# Altium schematic sheet PowerRails.SchDoc
size A4
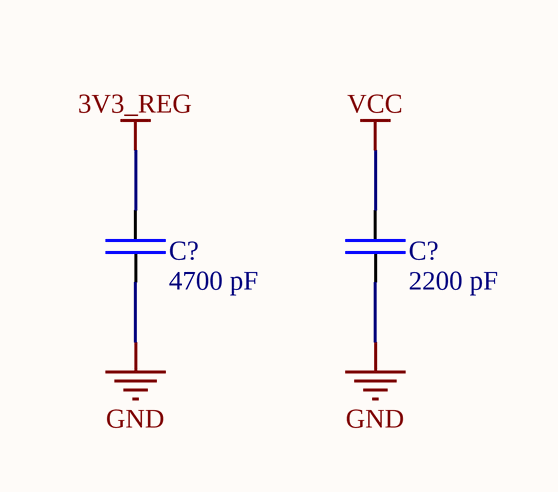
[diagram p0: PowerRails.SchDoc]

## Parts
(Parts that share a designator on the sheet are numbered #1, #2 ... from top to bottom, then left to right.)
C?#1  4700 pF  [4700uF 0805]
C?#2  2200 pF  [4700uF 0805]

## Nets
3V3_REG: C?#1.2
GND: C?#1.1 C?#2.1
VCC: C?#2.2

## Library data of the parts
C?#1 C?#2 = 4700pF 0805: KEMET - C0805C472K5RACTU - CERAMIC CAPACITOR 4700PF, 50V, X7R, 10%, 0805; Capacitance: 4.7nF; Rule: UNIONINDEX=0|RULEKIND=Width|NETSCOPE=AnyNet|LAYERKIND=SameLayer|NAME=Schematic Width Constraint|MAXLIMIT=15mil|MINLIMIT=15mil|PREFEREDWIDTH=15mil|MIDLAYER1_MINWIDTH=10mil|MIDLAYER1_MAXWIDTH=10mil|MIDLAYER1_PREFWIDTH=10mil|MIDLAYER2_MINWIDTH=10mil|MIDLAYER2_MAXWIDTH=10mil|MIDLAYER2_PREFWIDTH=10mil|MIDLAYER3_MINWIDTH=10mil|MIDLAYER3_MAXWIDTH=10mil|MIDLAYER3_PREFWIDTH=10mil|MIDLAYER4_MINWIDTH=10mil|MIDLAYER4_MAXWIDTH=10mil|MIDLAYER4_PREFWIDTH=10mil|MIDLAYER5_MINWIDTH=10mil|MIDLAYER5_MAXWIDTH=10mil|MIDLAYER5_PREFWIDTH=10mil|MIDLAYER6_MINWIDTH=10mil|MIDLAYER6_MAXWIDTH=10mil|MIDLAYER6_PREFWIDTH=10mil|MIDLAYER7_MINWIDTH=10mil|MIDLAYER7_MAXWIDTH=10mil|MIDLAYER7_PREFWIDTH=10mil|MIDLAYER8_MINWIDTH=10mil|MIDLAYER8_MAXWIDTH=10mil|MIDLAYER8_PREFWIDTH=10mil|MIDLAYER9_MINWIDTH=10mil|MIDLAYER9_MAXWIDTH=10mil|MIDLAYER9_PREFWIDTH=10mil|MIDLAYER10_MINWIDTH=10mil|MIDLAYER10_MAXWIDTH=10mil|MIDLAYER10_PREFWIDTH=10mil|MIDLAYER11_MINWIDTH=10mil|MIDLAYER11_MAXWIDTH=10mil|MIDLAYER11_PREFWIDTH=10mil|MIDLAYER12_MINWIDTH=10mil|MIDLAYER12_MAXWIDTH=10mil|MIDLAYER12_PREFWIDTH=10mil|MIDLAYER13_MINWIDTH=10mil|MIDLAYER13_MAXWIDTH=10mil|MIDLAYER13_PREFWIDTH=10mil|MIDLAYER14_MINWIDTH=10mil|MIDLAYER14_MAXWIDTH=10mil|MIDLAYER14_PREFWIDTH=10mil|MIDLAYER15_MINWIDTH=10mil|MIDLAYER15_MAXWIDTH=10mil|MIDLAYER15_PREFWIDTH=10mil|MIDLAYER16_MINWIDTH=10mil|MIDLAYER16_MAXWIDTH=10mil|MIDLAYER16_PREFWIDTH=10mil|MIDLAYER17_MINWIDTH=10mil|MIDLAYER17_MAXWIDTH=10mil|MIDLAYER17_PREFWIDTH=10mil|MIDLAYER18_MINWIDTH=10mil|MIDLAYER18_MAXWIDTH=10mil|MIDLAYER18_PREFWIDTH=10mil|MIDLAYER19_MINWIDTH=10mil|MIDLAYER19_MAXWIDTH=10mil|MIDLAYER19_PREFWIDTH=10mil|MIDLAYER20_MINWIDTH=10mil|MIDLAYER20_MAXWIDTH=10mil|MIDLAYER20_PREFWIDTH=10mil|MIDLAYER21_MINWIDTH=10mil|MIDLAYER21_MAXWIDTH=10mil|MIDLAYER21_PREFWIDTH=10mil|MIDLAYER22_MINWIDTH=10mil|MIDLAYER22_MAXWIDTH=10mil|MIDLAYER22_PREFWIDTH=10mil|MIDLAYER23_MINWIDTH=10mil|MIDLAYER23_MAXWIDTH=10mil|MIDLAYER23_PREFWIDTH=10mil|MIDLAYER24_MINWIDTH=10mil|MIDLAYER24_MAXWIDTH=10mil|MIDLAYER24_PREFWIDTH=10mil|MIDLAYER25_MINWIDTH=10mil|MIDLAYER25_MAXWIDTH=10mil|MIDLAYER25_PREFWIDTH=10mil|MIDLAYER26_MINWIDTH=10mil|MIDLAYER26_MAXWIDTH=10mil|MIDLAYER26_PREFWIDTH=10mil|MIDLAYER27_MINWIDTH=10mil|MIDLAYER27_MAXWIDTH=10mil|MIDLAYER27_PREFWIDTH=10mil|MIDLAYER28_MINWIDTH=10mil|MIDLAYER28_MAXWIDTH=10mil|MIDLAYER28_PREFWIDTH=10mil|MIDLAYER29_MINWIDTH=10mil|MIDLAYER29_MAXWIDTH=10mil|MIDLAYER29_PREFWIDTH=10mil|MIDLAYER30_MINWIDTH=10mil|MIDLAYER30_MAXWIDTH=10mil|MIDLAYER30_PREFWIDTH=10mil|MINIMP=50.000000|MAXIMP=50.000000|FAVIMP=50.000000|UNIT=Imperial; Supplier 1: Digi-Key; Supplier Part Number 1: 399-1155-1-ND; Manufacturer 1: KEMET; Manufacturer Part Number 1: C0805C472K5RACTU; Stock 1: 374666; Pricing 1: 1=0,10000, 10=0,06800, 100=0,03040, 500=0,02172, 1000=0,01706 (USD); RoHS: Yes; Mount: Surface Mount; Case/Package: 0805; Number of Pins: 2; Weight: 0.000194oz; Dielectric Material: Ceramic; Contact Plating: Tin,Matte; Case Code (Imperial): 0805; Case Code (Metric): 2012; Min Operating Temperature: -55°C; Max Operating Temperature: 125°C; Tolerance: 10%; Packaging: Tape and Reel; Dielectric: X7R; Voltage Rating (DC): 50V; Package Quantity: 1; Voltage Rating: 50V; Termination: SMD/SMT; Voltage: 50V; Length: 2mm; Height: 0.78mm; Depth: 1.25mm; Width: 0.049inch; Thickness: 0.035inch; Radiation Hardening: No; REACH SVHC: No SVHC; ComponentLink1URL: https://datasheet.ciiva.com/6074/kem-c1002-x7r-smd-6074679.pdf?src-supplier=Farnell; ComponentLink1Description: https://datasheet.ciiva.com/6074/kem-c1002-x7r-smd-6074679.pdf?src-supplier=Farnell; ComponentLink2URL: https://datasheet.ciiva.com/28682/1851736-28682318.pdf?src-supplier=Element14; ComponentLink2Description: https://datasheet.ciiva.com/28682/1851736-28682318.pdf?src-supplier=Element14